# EAGLE design backplane (EAGLE 9.6.2)
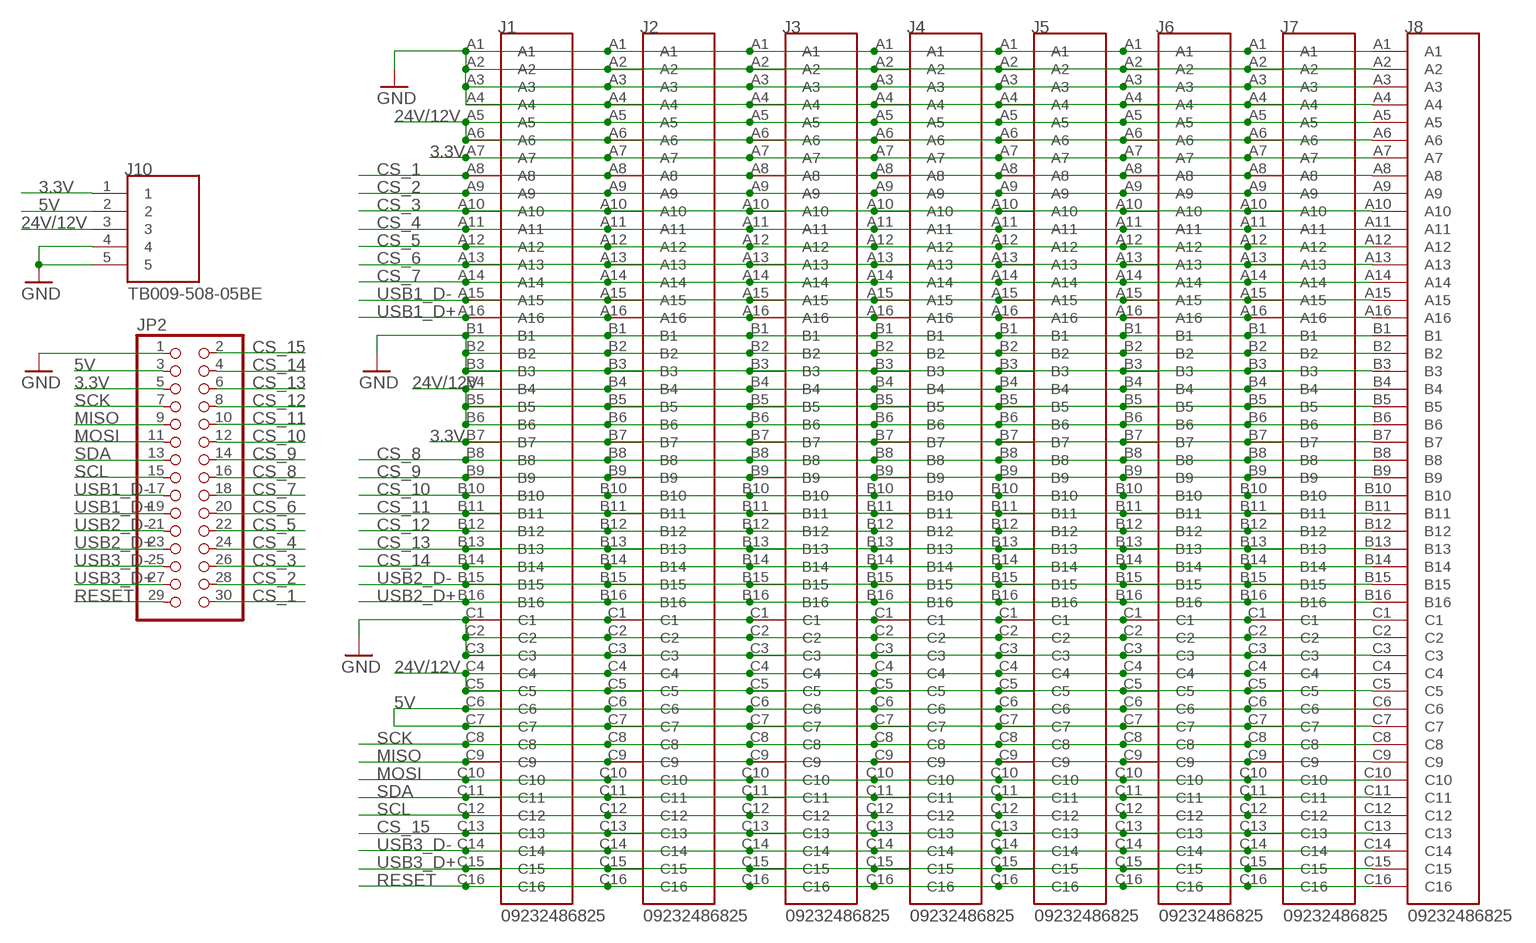
[diagram p0: schematic, sheet 1]

## Parts
J1  09232486825  [HARTING_09232486825]
J2  09232486825  [HARTING_09232486825]
J3  09232486825  [HARTING_09232486825]
J4  09232486825  [HARTING_09232486825]
J5  09232486825  [HARTING_09232486825]
J6  09232486825  [HARTING_09232486825]
J7  09232486825  [HARTING_09232486825]
J8  09232486825  [HARTING_09232486825]
J10  TB009-508-05BE  [CUI_TB009-508-05BE]
JP2  PINHD-2X15  [2X15]

## Nets
3.3V: J1.A7 J1.B7 J2.A7 J2.B7 J3.A7 J3.B7 J4.A7 J4.B7 J5.A7 J5.B7 J6.A7 J6.B7 J7.A7 J7.B7 J8.A7 J8.B7 J10.1 JP2.5
5V: J1.C6 J1.C7 J2.C6 J2.C7 J3.C6 J3.C7 J4.C6 J4.C7 J5.C6 J5.C7 J6.C6 J6.C7 J7.C6 J7.C7 J8.C6 J8.C7 J10.2 JP2.3
24V/12V: J1.A5 J1.A6 J1.B4 J1.B5 J1.B6 J1.C4 J1.C5 J2.A5 J2.A6 J2.B4 J2.B5 J2.B6 J2.C4 J2.C5 J3.A5 J3.A6 J3.B4 J3.B5 J3.B6 J3.C4 J3.C5 J4.A5 J4.A6 J4.B4 J4.B5 J4.B6 J4.C4 J4.C5 J5.A5 J5.A6 J5.B4 J5.B5 J5.B6 J5.C4 J5.C5 J6.A5 J6.A6 J6.B4 J6.B5 J6.B6 J6.C4 J6.C5 J7.A5 J7.A6 J7.B4 J7.B5 J7.B6 J7.C4 J7.C5 J8.A5 J8.A6 J8.B4 J8.B5 J8.B6 J8.C4 J8.C5 J10.3
CS_1: J1.A8 J2.A8 J3.A8 J4.A8 J5.A8 J6.A8 J7.A8 J8.A8 JP2.30
CS_2: J1.A9 J2.A9 J3.A9 J4.A9 J5.A9 J6.A9 J7.A9 J8.A9 JP2.28
CS_3: J1.A10 J2.A10 J3.A10 J4.A10 J5.A10 J6.A10 J7.A10 J8.A10 JP2.26
CS_4: J1.A11 J2.A11 J3.A11 J4.A11 J5.A11 J6.A11 J7.A11 J8.A11 JP2.24
CS_5: J1.A12 J2.A12 J3.A12 J4.A12 J5.A12 J6.A12 J7.A12 J8.A12 JP2.22
CS_6: J1.A13 J2.A13 J3.A13 J4.A13 J5.A13 J6.A13 J7.A13 J8.A13 JP2.20
CS_7: J1.A14 J2.A14 J3.A14 J4.A14 J5.A14 J6.A14 J7.A14 J8.A14 JP2.18
CS_8: J1.B8 J2.B8 J3.B8 J4.B8 J5.B8 J6.B8 J7.B8 J8.B8 JP2.16
CS_9: J1.B9 J2.B9 J3.B9 J4.B9 J5.B9 J6.B9 J7.B9 J8.B9 JP2.14
CS_10: J1.B10 J2.B10 J3.B10 J4.B10 J5.B10 J6.B10 J7.B10 J8.B10 JP2.12
CS_11: J1.B11 J2.B11 J3.B11 J4.B11 J5.B11 J6.B11 J7.B11 J8.B11 JP2.10
CS_12: J1.B12 J2.B12 J3.B12 J4.B12 J5.B12 J6.B12 J7.B12 J8.B12 JP2.8
CS_13: J1.B13 J2.B13 J3.B13 J4.B13 J5.B13 J6.B13 J7.B13 J8.B13 JP2.6
CS_14: J1.B14 J2.B14 J3.B14 J4.B14 J5.B14 J6.B14 J7.B14 J8.B14 JP2.4
CS_15: J1.C13 J2.C13 J3.C13 J4.C13 J5.C13 J6.C13 J7.C13 J8.C13 JP2.2
GND: J1.A1 J1.A2 J1.A3 J1.A4 J1.B1 J1.B2 J1.B3 J1.C1 J1.C2 J1.C3 J2.A1 J2.A2 J2.A3 J2.A4 J2.B1 J2.B2 J2.B3 J2.C1 J2.C2 J2.C3 J3.A1 J3.A2 J3.A3 J3.A4 J3.B1 J3.B2 J3.B3 J3.C1 J3.C2 J3.C3 J4.A1 J4.A2 J4.A3 J4.A4 J4.B1 J4.B2 J4.B3 J4.C1 J4.C2 J4.C3 J5.A1 J5.A2 J5.A3 J5.A4 J5.B1 J5.B2 J5.B3 J5.C1 J5.C2 J5.C3 J6.A1 J6.A2 J6.A3 J6.A4 J6.B1 J6.B2 J6.B3 J6.C1 J6.C2 J6.C3 J7.A1 J7.A2 J7.A3 J7.A4 J7.B1 J7.B2 J7.B3 J7.C1 J7.C2 J7.C3 J8.A1 J8.A2 J8.A3 J8.A4 J8.B1 J8.B2 J8.B3 J8.C1 J8.C2 J8.C3 J10.4 J10.5 JP2.1
MISO: J1.C9 J2.C9 J3.C9 J4.C9 J5.C9 J6.C9 J7.C9 J8.C9 JP2.9
MOSI: J1.C10 J2.C10 J3.C10 J4.C10 J5.C10 J6.C10 J7.C10 J8.C10 JP2.11
RESET: J1.C16 J2.C16 J3.C16 J4.C16 J5.C16 J6.C16 J7.C16 J8.C16 JP2.29
SCK: J1.C8 J2.C8 J3.C8 J4.C8 J5.C8 J6.C8 J7.C8 J8.C8 JP2.7
SCL: J1.C12 J2.C12 J3.C12 J4.C12 J5.C12 J6.C12 J7.C12 J8.C12 JP2.15
SDA: J1.C11 J2.C11 J3.C11 J4.C11 J5.C11 J6.C11 J7.C11 J8.C11 JP2.13
USB1_D+: J1.A16 J2.A16 J3.A16 J4.A16 J5.A16 J6.A16 J7.A16 J8.A16 JP2.19
USB1_D-: J1.A15 J2.A15 J3.A15 J4.A15 J5.A15 J6.A15 J7.A15 J8.A15 JP2.17
USB2_D+: J1.B16 J2.B16 J3.B16 J4.B16 J5.B16 J6.B16 J7.B16 J8.B16 JP2.23
USB2_D-: J1.B15 J2.B15 J3.B15 J4.B15 J5.B15 J6.B15 J7.B15 J8.B15 JP2.21
USB3_D+: J1.C15 J2.C15 J3.C15 J4.C15 J5.C15 J6.C15 J7.C15 J8.C15 JP2.27
USB3_D-: J1.C14 J2.C14 J3.C14 J4.C14 J5.C14 J6.C14 J7.C14 J8.C14 JP2.25

## Library data of the parts
J1-J8 = din41612_48_pin_backplane:09232486825: Check prices <https://pricing.snapeda.com/parts/5535070-4/TE%20Connectivity/view-part?ref=eda>; MANUFACTURER-PART-NUMBER: 09232486825; PACKAGE: None
J10 = TB009-508-05BE:TB009-508-05BE: Check prices <https://pricing.snapeda.com/parts/TB009-508-05BE/CUI%20Devices/view-part?ref=eda>; MANUFACTURER-PART-NUMBER: TB009-508-05BE; PACKAGE: None
JP2 = pinhead:PINHD-2X15: PIN HEADER; IGNORE-IN-BOM: True

## Net classes
1 POWER: clearance 0.508 mm

## Board
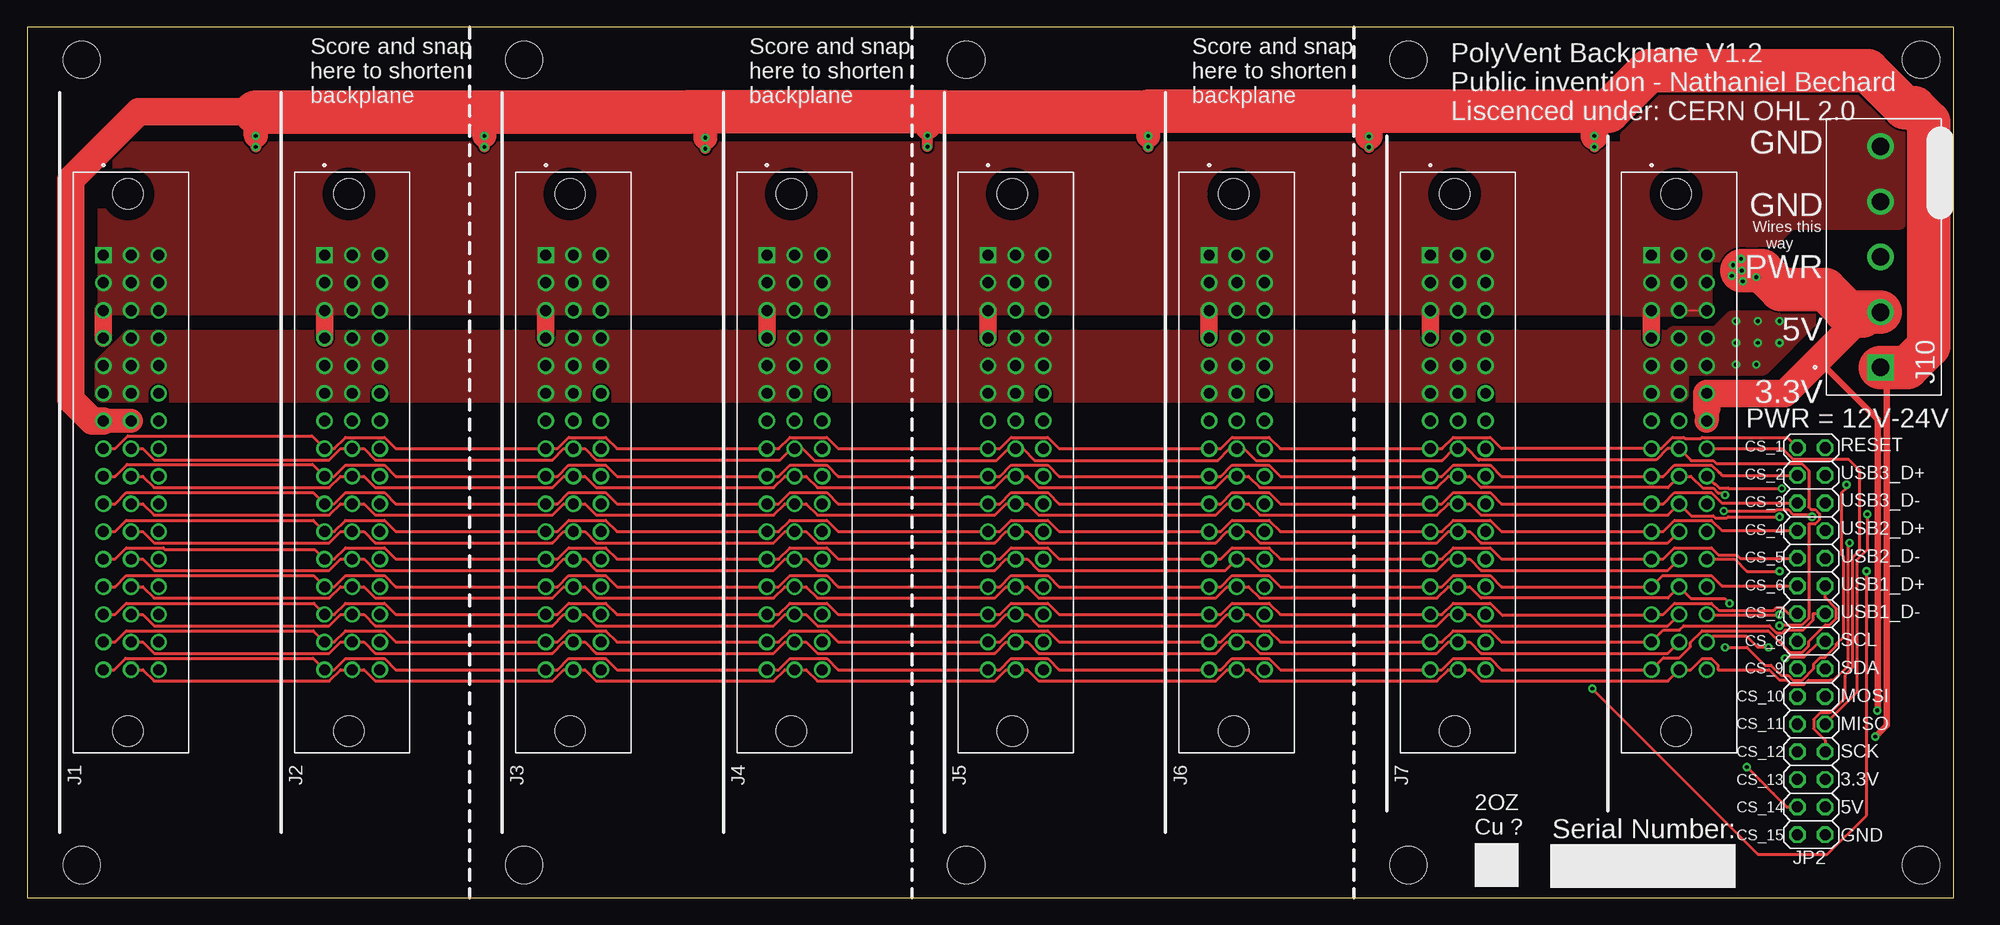
[diagram p1: board, top side]
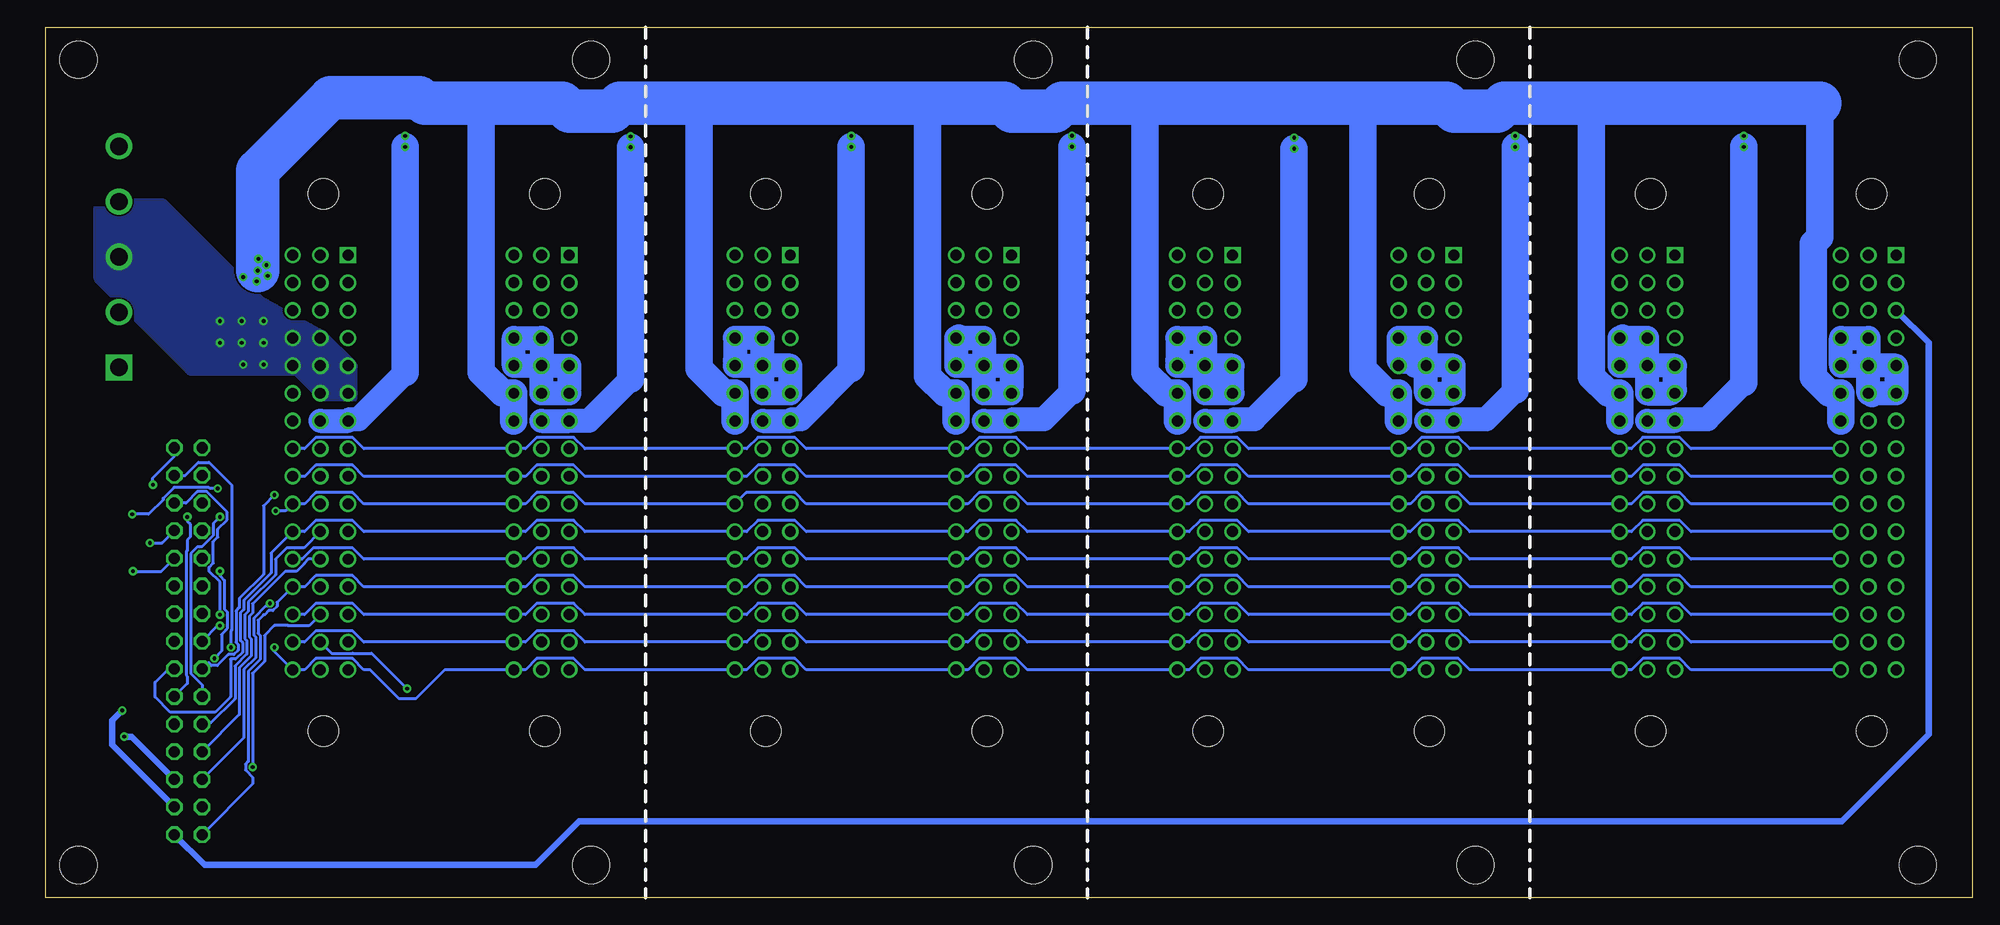
[diagram p2: board, bottom side, seen from below]

Size 177 x 80 mm. Coordinates in mm from the lower left corner, seen from the top.
Outline: 0,0 177,0 177,80 0,80 0,0
Copper layers (1*16): Top 0.035mm / dielectric 1.5mm / Bottom 0.035mm
Design rules "default": minimum track width 6mil, minimum drill 0.35mm, track to track 6mil, track to pad 6mil, pad to pad 6mil, via to via 6mil, smd to smd 6mil, copper to edge 40mil, drill to drill 6mil, minimum pad ring 10mil, minimum via ring 8mil, stop-mask expansion 4mil, vias tented up to drill 0mil, thermal gap 10mil
Holes 3.4 mm at 5,77 5,3 174,3 174,77 45.64,77 86.28,77 126.92,77 45.64,3 86.28,3 126.92,3

### Footprints (pad centres in the part's own frame; a part is rotated, then mirrored left to right if it is on the bottom)
HARTING_09232486825 = drill 1 pad 1.35 square: A1 0,0 | drill 1 pad 1.35: A2 -2.54,0; A3 -5.08,0; A4 -7.62,0; A5 -10.16,0; A6 -12.7,0; A7 -15.24,0; A8 -17.78,0; A9 -20.32,0; A10 -22.86,0; A11 -25.4,0; A12 -27.94,0; A13 -30.48,0; A14 -33.02,0; A15 -35.56,0; A16 -38.1,0; B1 0,-2.54; B2 -2.54,-2.54; B3 -5.08,-2.54; B4 -7.62,-2.54; B5 -10.16,-2.54; B6 -12.7,-2.54; B7 -15.24,-2.54; B8 -17.78,-2.54; B9 -20.32,-2.54; B10 -22.86,-2.54; B11 -25.4,-2.54; B12 -27.94,-2.54; B13 -30.48,-2.54; B14 -33.02,-2.54; B15 -35.56,-2.54; B16 -38.1,-2.54; C1 0,-5.08; C2 -2.54,-5.08; C3 -5.08,-5.08; C4 -7.62,-5.08; C5 -10.16,-5.08; C6 -12.7,-5.08; C7 -15.24,-5.08; C8 -17.78,-5.08; C9 -20.32,-5.08; C10 -22.86,-5.08; C11 -25.4,-5.08; C12 -27.94,-5.08; C13 -30.48,-5.08; C14 -33.02,-5.08; C15 -35.56,-5.08; C16 -38.1,-5.08 | hole 2.79: -43.74,-2.24; 5.64,-2.24
CUI_TB009-508-05BE = drill 1.6 square: 1 0,0 | drill 1.6: 2 5.08,0; 3 10.16,0; 4 15.24,0; 5 20.32,0
2X15 = drill 1.016 octagon: 1 -17.78,-1.27; 2 -17.78,1.27; 3 -15.24,-1.27; 4 -15.24,1.27; 5 -12.7,-1.27; 6 -12.7,1.27; 7 -10.16,-1.27; 8 -10.16,1.27; 9 -7.62,-1.27; 10 -7.62,1.27; 11 -5.08,-1.27; 12 -5.08,1.27; 13 -2.54,-1.27; 14 -2.54,1.27; 15 0,-1.27; 16 0,1.27; 17 2.54,-1.27; 18 2.54,1.27; 19 5.08,-1.27; 20 5.08,1.27; 21 7.62,-1.27; 22 7.62,1.27; 23 10.16,-1.27; 24 10.16,1.27; 25 12.7,-1.27; 26 12.7,1.27; 27 15.24,-1.27; 28 15.24,1.27; 29 17.78,-1.27; 30 17.78,1.27

### Placement (x,y rotation side)
J1  7,59.05 90 top
J2  27.32,59.05 90 top
J3  47.64,59.05 90 top
J4  67.96,59.05 90 top
J5  88.28,59.05 90 top
J6  108.6,59.05 90 top
J7  128.92,59.05 90 top
J8  149.24,59.05 90 top
J10  170.28,48.73 90 top
JP2  163.92,23.57 90 top

### Tracks (layer width: path | path; a pad name or v marks a point on that pad's centre or on a via)
3.3V  (via drill 0.35)
  Top 0.61: v169.8,14.8 170.84,15.84 170.84,47 | 170.84,47 170.84,47.52 | J10.1 170.28,47.55 170.84,47
  Top 1.016: 123.28,70.72 121.73,72.27 | 82.72,70.72 v82.72,70.03 v82.72,69.03 | v144,70 v144,69 | v42,69 v42,70 | v21,69 v21,70 | v62.31,68.84 v62.31,69.84 | v103,69 v103,70 | v123.28,68.97 v123.28,69.97
  Top 2.2: J1.B7 5.96,43.81 | v21,70 21,72.19 21,72.23 | v123.28,69.97 123.28,70.72 | v103,70 103,72.19 103,72.27 | 84.23,72.23 84.19,72.19 82.72,70.72 | v62.31,69.84 62.31,70.69 60.81,72.19 60.77,72.23 | v42,70 42,72.19
  Top 2.54: J1.A7 5.96,43.81 4,45.77 4,66 10.23,72.23 21,72.23 | v123.28,69.97 123.28,71.55 124,72.27 | v144,70 144,71 145.27,72.27
  Top 4: 103,72.27 121.73,72.27 124,72.27 145.27,72.27 149,76 169.13,76 172.53,72.6 173.4,72.6 174.71,71.29 174.71,50.71 172.73,48.73 J10.1 | 103,72.19 84.19,72.19 | 84.23,72.23 60.77,72.23 | 60.81,72.19 42,72.19 21,72.19
  Bottom 0.61: JP2.5 169.12,14.8 v169.8,14.8
  Bottom 2.2: J8.B7 J8.A7 149.06,43.99 148.26,43.99 144,48.25 | J2.B7 J2.A7 27.14,43.99 24.34,43.99 21,47.33 | J3.B7 J3.A7 47.46,43.99 44.66,43.99 42,46.65 | J4.B7 J4.A7 67.78,43.99 65.98,43.99 62.31,47.66 | J5.B7 J5.A7 88.1,43.99 85.3,43.99 82.72,46.57 | J6.B7 J6.A7 108.42,43.99 107.62,43.99 103,48.61 | J7.B7 J7.A7 128.89,43.84 127.09,43.84 123.28,47.65
  Bottom 2.54: 21,47.33 v21,69 | 42,46.65 v42,69 | 62.31,47.66 v62.31,68.84 | 82.72,46.57 v82.72,69.03 | 103,48.61 v103,69 | 123.28,47.65 v123.28,68.97 | 144,48.25 v144,69
5V  (via drill 0.35)
  Top 0.152: v157.55,57.63 157.63,57.55 v157.63,56.65 | v157.47,58.71 157.55,58.63 v157.55,57.63 | v157.55,57.63 157.35,57.83 157.03,57.83 v156.73,58.13 | v157.55,57.63 158.28,57.63 v158.88,57.03 158.77,57.14 v156.61,57.14
  Top 0.61: 164.58,49.42 170.04,43.96 170.04,17.26 v169.98,17.2
  Top 2.2: 154.32,45 J8.C7
  Top 2.54: 154.32,45 J8.C6 161.51,46.35 164.58,49.42 168.62,53.46 168.92,53.76
  Top 4: v157.55,57.63 159.37,57.63 161.11,55.89 165.2,55.89 167.32,53.76 | J10.2 167.19,53.81 | 167.19,53.81 167,54 | 168.62,53.46 168.32,53.76 167.32,53.76 | 167.32,53.76 167.24,53.76 167.19,53.81
  Bottom 0.61: v169.98,17.2 170.34,16.84 170.35,16.84 170.88,16.3 170.88,14.02 JP2.3
  Bottom 2.54: J7.C7 J7.C6 135.05,46.36 137,48.31 137,73 | J6.C7 J6.C6 114.73,46.36 117,48.63 117,73 | J5.C7 J5.C6 94.41,46.36 96,47.95 96,73 | J4.C7 J4.C6 74.09,46.36 76,48.27 76,73 | J3.C7 J3.C6 53.77,46.36 56,48.59 56,73 | J2.C7 J2.C6 33.45,46.36 35,47.91 35,73 | J1.C7 J1.C6 13.13,46.36 14.61,47.84 14.61,60.1 14,60.71 14,73
  Bottom 4: v157.55,57.63 157.55,66.83 150.84,73.53 142.69,73.53 142.16,73 137,73 129.59,73 128.87,72.28 124.97,72.28 124.25,73 117,73 96,73 88.95,73 88.23,72.28 84.33,72.28 83.61,73 76,73 56,73 48.31,73 47.59,72.28 43.69,72.28 42.97,73 35,73 14,73
24V/12V  (via drill 0.35)
  Bottom 2.2: J6.B5 J6.A5 J6.A6 J6.B6 J6.B5 | J6.B5 J6.B4 J6.C4 113.68,49.38 113.54,49.24 | J6.C5 J6.B5 | J7.B5 J7.B4 J7.C4 J7.C5 J7.B5 | J7.B5 J7.A5 128.92,46.84 129.06,46.7 | J7.A6 J7.B6 J7.B5 | J5.B5 J5.C5 J5.C4 J5.B4 | J5.B4 93.12,51.43 93.12,51.61 | J5.B4 J5.B5 | J5.B5 J5.A5 88.28,46.84 | 88.28,46.84 88.42,46.7 | 88.28,46.84 J5.A6 J5.B6 J5.B5 | 72.9,49.24 73.04,49.38 J4.C4 J4.B4 J4.B5 | J4.B5 J4.A5 J4.A6 J4.B6 J4.B5 | J4.B5 70.5,47.88 70.16,47.54 70.16,46.52 | J4.C5 J4.B5 | J3.B5 J3.B6 J3.A6 J3.A5 J3.B5 | J3.B5 J3.B4 J3.C4 52.72,49.38 52.58,49.24 51.54,49.24 51.19,48.89 J3.B5 | J2.B5 J2.A5 27.32,46.7 27.67,46.35 J2.B6 J2.B5 | J2.B5 J2.B4 32.12,51.43 32.12,51.61 | J2.C4 J2.C5 J2.B5 | J2.B5 30.87,48.89 31.22,49.24 32.12,49.24 | J1.B5 J1.B4 J1.C4 J1.C5 J1.B5 | J1.B5 J1.A5 J1.A6 9.2,46.35 9.2,46.17 | J1.B5 9.11,48.89 9,49 | J1.B6 J1.B5
  other vias: 157,51 157,49 159,51 161,53 161,51 158.88,49 159,53 157,53
  pour Top (no thermals): 7,49 7,46.3 29.9,46.3 29.9,48.8 29.8,48.9 32.4,48.9 32.4,51.4 9.4,51.4
  pour Top (no thermals): 27.4,49 27.4,46.3 50.3,46.3 50.3,48.8 50.2,48.9 52.8,48.9 52.8,51.4 29.8,51.4
  pour Top (no thermals): 47.72,49 47.72,46.3 70.62,46.3 70.62,48.8 70.52,48.9 73.12,48.9 73.12,51.4 50.12,51.4
  pour Top (no thermals): 68.04,49 68.04,46.3 90.94,46.3 90.94,48.8 90.84,48.9 93.44,48.9 93.44,51.4 70.44,51.4
  pour Top (no thermals): 88.36,49 88.36,46.3 111.26,46.3 111.26,48.8 111.16,48.9 113.76,48.9 113.76,51.4 90.76,51.4
  pour Top (no thermals): 108.66,49 108.66,46.3 131.56,46.3 131.56,48.8 131.46,48.9 134.06,48.9 134.06,51.4 111.06,51.4
  pour Top (no thermals): 128.98,49 128.98,46.3 151.88,46.3 151.88,48.8 151.78,48.9 154.38,48.9 154.38,51.4 131.38,51.4
  pour Top (no thermals): 149.3,49 149.3,46.3 151.7,51.4
  pour Bottom (no thermals): 149,46 149,48.85 151.69,51.54 157.42,54.7 166.33,63.61 172,63.61 172,57 163.61,48.61 153.89,48.61 151.55,46.27 149.27,46.27
  pour Top (no thermals): 151.2,48.65 159.5,48.65 164.15,53.3 156.61,53.3 155.19,51.88 151.2,51.88
CS_1
  Top 0.254: J1.A8 8.08,41.27 9.24,42.43 26.16,42.43 J2.A8 28.21,41.27 29.24,42.3 32.83,42.3 33.86,41.27 J3.A8 48.72,41.27 49.75,42.3 53.15,42.3 54.18,41.27 J4.A8 69.04,41.27 70.07,42.3 73.47,42.3 74.5,41.27 J5.A8 89.36,41.27 90.39,42.3 93.79,42.3 94.82,41.27 J6.A8 109.68,41.27 110.71,42.3 114.11,42.3 115.14,41.27 J7.A8 130,41.27 131.03,42.3 134.43,42.3 135.46,41.27 J8.A8 150.13,41.27 151.16,42.3 152.21,42.3 152.31,42.21 153.79,42.21 153.89,42.3 161.7,42.3 JP2.30
CS_2
  Top 0.254: J1.A9 8.08,38.73 9.18,39.83 26.22,39.83 J2.A9 28.21,38.73 29.24,39.76 32.83,39.76 33.86,38.73 J3.A9 48.72,38.73 49.75,39.76 53.15,39.76 54.18,38.73 J4.A9 69.04,38.73 70.07,39.76 73.47,39.76 74.5,38.73 J5.A9 89.36,38.73 90.39,39.76 93.79,39.76 94.82,38.73 J6.A9 109.68,38.73 110.71,39.76 114.11,39.76 115.14,38.73 J7.A9 130,38.73 131.03,39.76 134.43,39.76 135.46,38.73 J8.A9 150.32,38.73 151.35,39.76 154.75,39.76 155.46,39.05 155.52,39.05 155.76,38.81 JP2.28
CS_3
  Top 0.254: J1.A10 8.08,36.19 9.11,37.22 26.29,37.22 J2.A10 28.21,36.19 29.24,37.22 32.83,37.22 33.86,36.19 J3.A10 48.72,36.19 49.75,37.22 53.15,37.22 54.18,36.19 J4.A10 69.04,36.19 70.07,37.22 73.47,37.22 74.5,36.19 J5.A10 89.36,36.19 90.39,37.22 93.79,37.22 94.82,36.19 J6.A10 109.68,36.19 110.71,37.22 114.11,37.22 115.14,36.19 J7.A10 130,36.19 131.03,37.22 134.43,37.22 135.46,36.19 J8.A10 150.32,36.19 151.35,37.22 154.75,37.22 155.7,36.27 JP2.26
CS_4
  Top 0.254: J1.A11 8.08,33.65 9.11,34.68 26.29,34.68 J2.A11 28.21,33.65 29.24,34.68 32.83,34.68 33.86,33.65 J3.A11 48.72,33.65 49.75,34.68 53.15,34.68 54.18,33.65 J4.A11 69.04,33.65 70.07,34.68 73.47,34.68 74.5,33.65 J5.A11 89.36,33.65 90.39,34.68 93.79,34.68 94.82,33.65 J6.A11 109.68,33.65 110.71,34.68 114.11,34.68 115.14,33.65 J7.A11 130,33.65 131.03,34.68 134.43,34.68 135.46,33.65 J8.A11 150.32,33.65 151.35,34.68 154.75,34.68 155.7,33.73 JP2.24
CS_5
  Top 0.254: J1.A12 8.08,31.11 9.11,32.14 12.51,32.14 12.65,32 26.43,32 J2.A12 28.21,31.11 29.24,32.14 32.83,32.14 33.86,31.11 J3.A12 48.72,31.11 49.75,32.14 53.15,32.14 54.18,31.11 J4.A12 69.04,31.11 70.07,32.14 73.47,32.14 74.5,31.11 J5.A12 89.36,31.11 90.39,32.14 93.79,32.14 94.82,31.11 J6.A12 109.68,31.11 110.71,32.14 114.11,32.14 115.14,31.11 J7.A12 130,31.11 131.03,32.14 134.43,32.14 135.46,31.11 J8.A12 150.32,31.11 151.35,32.14 154.75,32.14 155.38,31.52 157.06,31.52 157.38,31.19 JP2.22
CS_6
  Top 0.254: J1.A13 8.08,28.57 9.11,29.6 12.51,29.6 26.3,29.6 J2.A13 28.21,28.57 29.24,29.6 32.83,29.6 33.86,28.57 J3.A13 48.72,28.57 49.75,29.6 53.15,29.6 54.18,28.57 J4.A13 69.04,28.57 70.07,29.6 73.47,29.6 74.5,28.57 J5.A13 89.36,28.57 90.39,29.6 93.79,29.6 94.82,28.57 J6.A13 109.68,28.57 110.71,29.6 114.11,29.6 115.14,28.57 J7.A13 130,28.57 131.03,29.6 134.43,29.6 135.46,28.57 J8.A13 150.27,29.6 154.75,29.6 155.7,28.65 JP2.20
CS_7
  Top 0.254: J1.A14 8.08,26.03 9.11,27.06 26.34,27.06 27.32,26.08 J2.A14 28.21,26.03 29.24,27.06 32.83,27.06 33.86,26.03 J3.A14 48.72,26.03 49.75,27.06 53.15,27.06 54.18,26.03 J4.A14 69.04,26.03 70.07,27.06 73.47,27.06 74.5,26.03 J5.A14 89.36,26.03 90.39,27.06 93.79,27.06 94.82,26.03 J6.A14 109.68,26.03 110.71,27.06 114.11,27.06 115.14,26.03 J7.A14 130,26.03 131.03,27.06 134.43,27.06 135.56,25.94 149.15,25.94 J8.A14 150.32,26.03 151.35,27.06 154.75,27.06 155.43,26.38 156.68,26.38 156.71,26.41 160.48,26.41 160.73,26.66 161.27,26.66 161.82,26.11 JP2.18
CS_8  (via drill 0.35)
  Top 0.254: J1.B8 10.62,41.27 11.65,40.24 27.75,40.24 28.78,41.27 J2.B8 30.94,41.27 31.97,40.24 48.26,40.24 49.29,41.27 J3.B8 51.26,41.27 52.29,40.24 69.18,40.24 70.21,41.27 J4.B8 71.25,41.27 72.33,40.19 89.08,40.19 90.16,41.27 J5.B8 91.47,41.27 92.55,40.19 109.4,40.19 110.48,41.27 J6.B8 111.79,41.27 112.87,40.19 130.02,40.19 131.1,41.27 J7.B8 132.31,41.27 133.29,40.29 | 133.29,40.29 133.39,40.19 | 133.29,40.29 133.52,40.29 133.57,40.24 149.67,40.24 150.7,41.27 J8.B8 152.88,40.17 154.92,40.17 155.18,39.9 163.03,39.9 163.69,39.24 163.69,35.88 163.92,35.66 164.27,35.66 164.66,35.27 164.66,34.73 164.27,34.34 163.69,34.34 163.69,25.68 163.08,25.07 163.05,25.07 163,25.02 162.05,25.02 162.03,25 v161,25
  Bottom 0.254: v161,25 161.22,25 JP2.16
CS_9  (via drill 0.35)
  Top 0.254: J1.B9 10.62,38.73 11.65,37.7 27.75,37.7 28.78,38.73 J2.B9 30.94,38.73 31.97,37.7 48.26,37.7 49.29,38.73 J3.B9 51.26,38.73 52.29,37.7 68.58,37.7 69.61,38.73 J4.B9 71.58,38.73 72.61,37.7 88.9,37.7 89.93,38.73 J5.B9 91.9,38.73 92.93,37.7 109.22,37.7 110.25,38.73 J6.B9 112.22,38.73 113.25,37.7 129.54,37.7 130.57,38.73 J7.B9 132.54,38.73 133.57,37.7 150.75,37.7 J8.B9 152.86,38.73 153.96,37.63 154.92,37.63 155.34,37.2 155.8,37.2 v156,37
  Bottom 0.254: v156,37 157,36 157,29.72 159.22,27.5 159.22,26.65 159.53,26.34 159.53,23.46 159.34,23.27 159.34,22.73 159.73,22.34 160.24,22.34 161.24,21.34 161.78,21.34 162.06,21.62 JP2.14
CS_10  (via drill 0.35)
  Top 0.254: J1.B10 10.62,36.19 11.65,35.16 27.75,35.16 28.78,36.19 J2.B10 30.94,36.19 31.97,35.16 48.26,35.16 49.29,36.19 J3.B10 51.26,36.19 52.29,35.16 68.58,35.16 69.61,36.19 J4.B10 71.58,36.19 72.61,35.16 88.9,35.16 89.93,36.19 J5.B10 91.9,36.19 92.93,35.16 109.22,35.16 110.25,36.19 J6.B10 112.22,36.19 113.25,35.16 129.54,35.16 130.57,36.19 J7.B10 132.54,36.19 133.57,35.16 150.75,35.16 J8.B10 152.88,35.09 154.92,35.09 155.12,34.88 156.15,34.88 156.27,35 v161,35
  Bottom 0.254: v161,35 161.61,34.39 161.61,33.3 162.68,32.23 163.08,32.23 163.69,31.62 163.69,20.6 162.65,19.56 JP2.12
CS_11
  Top 0.254: J1.B11 10.62,33.65 11.65,32.62 27.75,32.62 28.78,33.65 J2.B11 30.94,33.65 31.97,32.62 48.26,32.62 49.29,33.65 J3.B11 51.26,33.65 52.29,32.62 68.58,32.62 69.61,33.65 J4.B11 71.58,33.65 72.61,32.62 88.9,32.62 89.93,33.65 J5.B11 91.9,33.65 92.93,32.62 109.22,32.62 110.25,33.65 J6.B11 112.22,33.65 113.25,32.62 129.54,32.62 130.57,33.65 J7.B11 132.54,33.65 133.57,32.62 150.75,32.62 J8.B11
  Bottom 0.254: J8.B11 153.29,32.14 154.86,32.14 155.89,31.11 155.89,29.68 158.41,27.17 158.41,26.32 158.72,26.01 158.72,23.8 158.53,23.61 158.53,22.39 159.63,21.3 159.63,18.29 161.97,15.95 JP2.10
CS_12
  Top 0.254: J1.B12 10.62,31.11 11.65,30.08 27.75,30.08 28.78,31.11 J2.B12 30.94,31.11 31.97,30.08 48.26,30.08 49.29,31.11 J3.B12 51.26,31.11 52.29,30.08 68.58,30.08 69.61,31.11 J4.B12 71.58,31.11 72.61,30.08 88.9,30.08 89.93,31.11 J5.B12 91.9,31.11 92.93,30.08 110.11,30.08 J6.B12 112.22,31.11 113.25,30.08 129.54,30.08 130.57,31.11 J7.B12 132.54,31.11 133.57,30.08 150.75,30.08 J8.B12
  Bottom 0.254: J8.B12 152.89,31.11 153.29,30.71 153.29,30.68 153.97,30 155,30 158,27 158,26.15 158.31,25.84 158.31,23.96 158.12,23.78 158.12,22.22 159.22,21.13 159.22,16.84 JP2.8
CS_13  (via drill 0.35)
  Top 0.254: J1.B13 10.62,28.57 11.65,27.54 27.75,27.54 28.78,28.57 J2.B13 30.94,28.57 31.97,27.54 48.26,27.54 49.29,28.57 J3.B13 51.26,28.57 52.29,27.54 68.58,27.54 69.61,28.57 J4.B13 71.58,28.57 72.61,27.54 88.9,27.54 89.93,28.57 J5.B13 91.9,28.57 92.93,27.54 109.22,27.54 110.25,28.57 J6.B13 112.22,28.57 113.25,27.54 129.54,27.54 130.57,28.57 J7.B13 132.54,28.57 133.57,27.54 150.75,27.54 J8.B13 152.87,27.48 155.97,27.48 v156.41,27.04
  Bottom 0.254: v156.41,27.04 156.66,26.79 156.79,26.79 157.9,25.67 157.9,24.13 157.72,23.95 157.72,22.05 158.81,20.96 158.81,14.71 JP2.6
CS_14  (via drill 0.35)
  Top 0.254: J1.B14 10.62,26.03 11.65,25 27.75,25 28.78,26.03 J2.B14 30.94,26.03 31.97,25 48.26,25 49.29,26.03 J3.B14 51.26,26.03 52.29,25 68.58,25 69.61,26.03 J4.B14 71.58,26.03 72.61,25 88.9,25 89.93,26.03 J5.B14 91.9,26.03 92.93,25 109.22,25 110.25,26.03 J6.B14 112.22,26.03 113.25,25 129.54,25 130.57,26.03 J7.B14 132.54,26.03 133.57,25 150.75,25 J8.B14 | v158,12 arc1 161.67,8.33 JP2.4
  Bottom 0.254: J8.B14 152.81,25 154.75,25 156,25 156.9,24.1 156.9,21.72 158,20.62 v158,12
CS_15
  Bottom 0.254: J1.C13 25.86,28.57 26.89,29.6 30.29,29.6 31.32,28.57 J2.C13 46.18,28.57 47.21,29.6 50.61,29.6 51.64,28.57 J3.C13 66.5,28.57 67.53,29.6 70.93,29.6 71.96,28.57 J4.C13 86.82,28.57 87.85,29.6 91.25,29.6 92.28,28.57 J5.C13 107.14,28.57 108.17,29.6 111.57,29.6 112.6,28.57 J6.C13 127.46,28.57 128.49,29.6 131.89,29.6 132.92,28.57 J7.C13 147.78,28.57 148.81,29.6 152.21,29.6 153.24,28.57 J8.C13 155.75,27.14 155.75,26.77 156.14,26.38 156.51,26.38 156.89,26 157,26 157.5,25.5 157.5,24.3 157.31,24.11 157.31,21.89 158.41,20.79 158.41,12.52 158.66,12.27 158.66,11.73 158,11.07 158,10.44 JP2.2
GND
  Top 0.152: J8.C3 J8.B3
  Top 1.6: J1.A4 J1.A3 | J2.A3 J2.A4 | J3.A3 J3.A4 | J4.A3 J4.A4 | J5.A3 J5.A4 | J6.A3 J6.A4 | J7.A3 J7.A4 | J8.A3 J8.A4
  Bottom 0.61: JP2.1 162.4,3 132,3 128,7 12,7 4,15 4,51 6.97,53.97 J1.A3
  pour Top (no thermals): 7,54 7,69 154.3,69 154.3,54
  pour Top (no thermals): 147,54 147,70 151,74 172,74 172,62 162,62 159,59 154,59 154,54
MISO  (via drill 0.35)
  Top 0.254: v161.22,37.61 156.32,37.61 156.27,37.66 155.46,37.66 155.09,38.04 155.01,38.04 J8.C9 | JP2.9 168.11,18.87 168.11,31.04 169.07,32 v169.07,35.24
  Bottom 0.254: J1.C9 25.86,38.73 26.89,39.76 30.29,39.76 31.32,38.73 J2.C9 46.18,38.73 47.21,39.76 50.61,39.76 51.64,38.73 J3.C9 66.5,38.73 67.53,39.76 70.93,39.76 71.96,38.73 J4.C9 86.82,38.73 87.85,39.76 91.25,39.76 92.28,38.73 J5.C9 107.14,38.73 108.17,39.76 111.57,39.76 112.6,38.73 J6.C9 127.46,38.73 128.49,39.76 131.89,39.76 132.92,38.73 J7.C9 147.78,38.73 148.81,39.76 152.21,39.76 153.24,38.73 J8.C9 | v161.22,37.61 161.94,37.61 162.05,37.72 165.22,37.72 166.23,36.7 166.23,36.57 167.56,35.24 v169.07,35.24
MOSI  (via drill 0.35)
  Top 0.254: v155.88,35.54 160.61,35.54 160.73,35.66 161.79,35.66 162.22,35.23 163.77,35.23 v164,35
  Bottom 0.254: J1.C10 25.86,36.19 26.89,37.22 30.29,37.22 31.32,36.19 J2.C10 46.18,36.19 47.21,37.22 50.61,37.22 51.64,36.19 J3.C10 66.5,36.19 67.53,37.22 70.93,37.22 71.96,36.19 J4.C10 86.82,36.19 87.85,37.22 91.25,37.22 92.28,36.19 J5.C10 107.14,36.19 108.17,37.22 112.65,37.22 J6.C10 127.46,36.19 128.49,37.22 131.89,37.22 132.92,36.19 J7.C10 147.78,36.19 148.81,37.22 152.21,37.22 153.24,36.19 J8.C10 154.97,35.54 v155.88,35.54 | JP2.11 164,19.68 164,20.33 164.1,20.43 164.1,31.79 164,31.89 164,32.87 163.74,33.13 163.74,34.33 164,34.59 v164,35
RESET  (via drill 0.35)
  Top 0.254: v156,23 158,23 159.64,21.36 160.22,21.36 161.17,20.41 161.8,20.41 162.22,19.99 163.08,19.99 164.15,21.06 164.15,21.46 164.76,22.07 165.16,22.07 166.23,23.14 166.23,23.3 166.89,23.96 166.89,31.35 166.71,31.53 166.71,37.22 167.3,37.81 v167.16,37.95
  Bottom 0.254: J1.C16 25.86,20.95 26.89,21.98 30.29,21.98 31.32,20.95 J2.C16 46.18,20.95 47.21,21.98 50.61,21.98 51.59,21 52.77,21 | 52.77,21 J3.C16 66.5,20.95 67.53,21.98 70.93,21.98 71.96,20.95 J4.C16 86.82,20.95 87.85,21.98 91.25,21.98 92.28,20.95 J5.C16 107.14,20.95 108.17,21.98 111.57,21.98 112.6,20.95 J6.C16 127.46,20.95 128.49,21.98 131.89,21.98 132.92,20.95 J7.C16 140.35,20.95 143.02,18.28 144.55,18.28 147.22,20.95 147.78,20.95 148.81,21.98 152.21,21.98 153.24,20.95 J8.C16 156,22.63 v156,23 | 52.77,21 53,21 | v167.16,37.95 167.16,38.59 165.19,40.56 JP2.29
SCK
  Top 0.254: J8.C8 161.26,41.27 162.22,40.31 167.33,40.31 168.33,39.31 168.33,31.83 167.71,31.21 167.71,21.13 167,20.43 167,18.34 165.66,16.99 164.76,16.99 164.15,16.38 164.15,15.52 165.19,14.48 JP2.7
  Bottom 0.254: J1.C8 25.86,41.27 26.89,42.3 30.29,42.3 31.32,41.27 J2.C8 46.18,41.27 47.21,42.3 50.61,42.3 51.64,41.27 J3.C8 66.5,41.27 67.53,42.3 70.93,42.3 71.96,41.27 J4.C8 86.82,41.27 87.85,42.3 91.25,42.3 92.28,41.27 J5.C8 107.14,41.27 108.17,42.3 111.57,42.3 112.6,41.27 J6.C8 127.46,41.27 128.49,42.3 131.89,42.3 132.92,41.27 J7.C8 147.78,41.27 148.81,42.3 152.21,42.3 153.24,41.27 J8.C8
SCL  (via drill 0.35)
  Top 0.254: J8.C12 156.89,31.11 158,30 v161,30 | v161.51,22 161.63,22.12 163.25,22.12 164.7,23.57 JP2.15
  Bottom 0.254: J1.C12 25.86,31.11 26.89,32.14 30.29,32.14 31.32,31.11 J2.C12 46.18,31.11 47.21,32.14 50.61,32.14 51.64,31.11 J3.C12 66.5,31.11 67.53,32.14 70.93,32.14 71.96,31.11 J4.C12 86.82,31.11 87.85,32.14 91.25,32.14 92.28,31.11 J5.C12 107.14,31.11 108.17,32.14 111.57,32.14 112.6,31.11 J6.C12 127.46,31.11 128.49,32.14 131.89,32.14 132.92,31.11 J7.C12 147.78,31.11 148.81,32.14 152.43,32.14 153.47,31.11 J8.C12 | v161.51,22 160.84,22.66 160.84,24.18 160.44,24.59 160.44,24.63 160.34,24.73 160.34,26.27 160.59,26.52 160.59,29.17 161,29.57 v161,30
SDA
  Bottom 0.254: J1.C11 25.86,33.65 26.89,34.68 30.29,34.68 31.32,33.65 J2.C11 46.18,33.65 47.21,34.68 50.61,34.68 51.64,33.65 J3.C11 66.5,33.65 67.53,34.68 70.93,34.68 71.96,33.65 J4.C11 86.82,33.65 87.85,34.68 91.25,34.68 92.28,33.65 J5.C11 107.14,33.65 108.17,34.68 111.57,34.68 112.6,33.65 J6.C11 127.46,33.65 128.49,34.68 131.89,34.68 132.92,33.65 J7.C11 147.78,33.65 148.81,34.68 152.21,34.68 153.24,33.65 J8.C11 156.3,31.67 156.3,29.85 158.81,27.34 158.81,26.49 159.12,26.18 159.12,23.63 158.94,23.44 158.94,22.56 159.56,21.94 160.03,21.94 160.03,18.46 161.45,17.04 165.57,17.04 166.96,18.43 166.96,19.8 165.73,21.03 JP2.13
USB1_D+
  Top 0.254: J1.A16 8,20.95 9.05,22 26.27,22 J2.A16 28.21,20.95 29.24,21.98 32.83,21.98 33.86,20.95 J3.A16 48.72,20.95 49.75,21.98 53.15,21.98 54.18,20.95 J4.A16 69.04,20.95 70.07,21.98 73.47,21.98 74.5,20.95 J5.A16 89.36,20.95 90.39,21.98 93.79,21.98 94.82,20.95 J6.A16 109.68,20.95 110.71,21.98 114.11,21.98 115.14,20.95 J7.A16 130,20.95 131.03,21.98 134.43,21.98 135.46,20.95 J8.A16 150.34,22.05 151.8,22.05 152.81,23.06 152.81,23.45 153.89,24.52 159.97,24.52 161.97,22.53 163.08,22.53 163.69,23.14 163.69,23.54 165.22,25.07 165.62,25.07 166.23,25.68 166.23,26.54 165.19,27.58 JP2.19
USB1_D-
  Top 0.254: J1.A15 8.08,23.49 9.11,24.52 26.29,24.52 J2.A15 28.21,23.49 29.24,24.52 32.83,24.52 33.86,23.49 J3.A15 48.72,23.49 49.75,24.52 53.15,24.52 54.18,23.49 J4.A15 69.04,23.49 70.07,24.52 73.47,24.52 74.5,23.49 J5.A15 89.36,23.49 90.39,24.52 93.79,24.52 94.82,23.49 J6.A15 109.68,23.49 110.71,24.52 114.11,24.52 115.14,23.49 J7.A15 130,23.49 131.03,24.52 134.43,24.52 135.46,23.49 J8.A15 150.34,24.59 151.8,24.59 152.21,25 160.07,25 160.73,24.34 161.27,24.34 161.52,24.59 162.2,24.59 162.22,24.61 163.2,24.61 164.1,25.51 164.1,26.09 164.12,26.11 JP2.17
USB2_D+  (via drill 0.35)
  Top 0.254: J1.B16 10.62,20.95 11.65,19.92 27.75,19.92 28.78,20.95 J2.B16 30.94,20.95 31.97,19.92 48.26,19.92 49.29,20.95 J3.B16 51.26,20.95 52.29,19.92 68.58,19.92 69.61,20.95 J4.B16 71.58,20.95 72.61,19.92 88.9,19.92 89.93,20.95 J5.B16 91.9,20.95 92.93,19.92 109.22,19.92 110.25,20.95 J6.B16 112.22,20.95 113.25,19.92 129.54,19.92 130.57,20.95 J7.B16 132.54,20.95 133.57,19.92 150.75,19.92 J8.B16 152.86,20.95 153.89,21.98 154.75,21.98 155.35,21.38 155.35,20.95 160.05,20.95 161,20 161.63,20 162.05,19.58 163.25,19.58 163.66,19.99 165.62,19.99 165.63,20 166,20 167.3,21.3 167.3,32.6 v167.44,32.6
  Bottom 0.254: v167.44,32.6 166.32,32.6 JP2.23
USB2_D-  (via drill 0.35)
  Top 0.254: J1.B15 10.62,23.49 11.65,22.46 27.75,22.46 28.78,23.49 J2.B15 30.94,23.49 31.97,22.46 48.26,22.46 49.29,23.49 J3.B15 51.26,23.49 52.29,22.46 68.58,22.46 69.61,23.49 J4.B15 71.58,23.49 72.61,22.46 88.9,22.46 89.93,23.49 J5.B15 91.9,23.49 92.93,22.46 109.22,22.46 110.25,23.49 J6.B15 112.22,23.49 113.25,22.46 129.54,22.46 130.57,23.49 J7.B15 132.54,23.49 133.57,22.46 150.75,22.46 J8.B15 | v143.81,19.21 159.02,4 165.41,4 169,7.59 v169,30
  Bottom 0.254: J8.B15 150.75,22.46 148.81,22.46 148.8,22.47 147.07,22.47 v143.81,19.21 | v169,30 166.38,30 JP2.21
USB3_D+  (via drill 0.35)
  Top 0.254: v160,23 159,23 158,24 154.83,24 J8.C15
  Bottom 0.254: J1.C15 25.86,23.49 26.89,24.52 30.29,24.52 31.32,23.49 J2.C15 46.18,23.49 47.21,24.52 50.61,24.52 51.64,23.49 J3.C15 66.5,23.49 67.53,24.52 70.93,24.52 71.96,23.49 J4.C15 86.82,23.49 87.85,24.52 91.25,24.52 92.28,23.49 J5.C15 107.14,23.49 108.17,24.52 111.57,24.52 112.6,23.49 J6.C15 127.46,23.49 128.49,24.52 131.89,24.52 132.92,23.49 J7.C15 147.78,23.49 148.81,24.52 152.21,24.52 153.24,23.49 J8.C15 | JP2.27 164.19,38.81 163,40 162,40 159.94,37.94 159.94,24.56 160,24.5 v160,23
USB3_D-  (via drill 0.35)
  Top 0.254: v161,26 156.88,26 156.85,25.98 154.37,25.98 J8.C14
  Bottom 0.254: J1.C14 25.86,26.03 26.89,27.06 30.29,27.06 31.32,26.03 J2.C14 46.18,26.03 47.21,27.06 50.61,27.06 51.64,26.03 J3.C14 66.5,26.03 67.53,27.06 70.93,27.06 71.96,26.03 J4.C14 86.82,26.03 87.85,27.06 91.25,27.06 92.28,26.03 J5.C14 107.14,26.03 108.17,27.06 111.57,27.06 112.6,26.03 J6.C14 127.46,26.03 128.49,27.06 131.89,27.06 132.92,26.03 J7.C14 147.78,26.03 148.81,27.06 152.21,27.06 153.24,26.03 J8.C14 | v161,26 161,29 162,30 162,30.37 161.61,30.76 161.61,32.72 161.2,33.13 161.2,33.87 160.34,34.73 160.34,35.44 162.22,37.31 163.08,37.31 164.12,36.27 JP2.25

### Text on the board
tNames: Score and snap / here to shorten / backplane | Score and snap / here to shorten / backplane | Score and snap / here to shorten / backplane | PolyVent Backplane V1.2 / Public invention - Nathaniel Bechard / Liscenced under: CERN OHL 2.0 | Wires this / way | GND / / GND / / PWR / / 5V / / 3.3V | PWR = 12V-24V | Serial Number: | 2OZ / Cu ? | CS_1 / CS_2 / CS_3 / CS_4 / CS_5 / CS_6 / CS_7 / CS_8 / CS_9 / CS_10 / CS_11 / CS_12 / CS_13 / CS_14 / CS_15 | RESET / USB3_D+ / USB3_D- / USB2_D+ / USB2_D- / USB1_D+ / USB1_D- / SCL / SDA / MOSI / MISO / SCK / 3.3V / 5V / GND